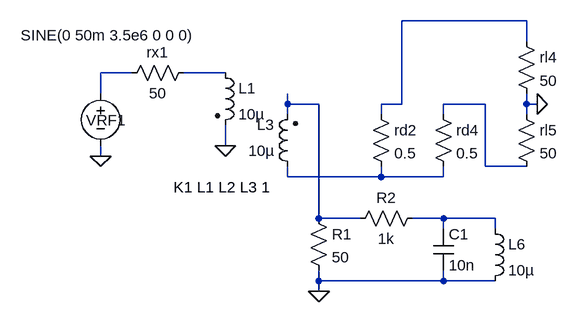
[diagram p0: schematic Draft1.asc]
Draft1.asc, the LTspice schematic file:
Version 4
SHEET 1 880 680
WIRE 512 0 320 0
WIRE 512 32 512 0
WIRE -96 80 -144 80
WIRE 48 80 -16 80
WIRE -144 112 -144 80
WIRE 144 128 144 112
WIRE 192 128 144 128
WIRE 320 128 320 0
WIRE 320 128 288 128
WIRE 448 128 384 128
WIRE 512 128 512 112
WIRE 528 128 512 128
WIRE 144 144 144 128
WIRE 288 144 288 128
WIRE 384 144 384 128
WIRE 512 144 512 128
WIRE 48 192 48 160
WIRE -144 208 -144 192
WIRE 448 224 448 128
WIRE 512 224 448 224
WIRE 144 240 144 224
WIRE 288 240 288 224
WIRE 288 240 144 240
WIRE 384 240 384 224
WIRE 384 240 288 240
WIRE 192 304 192 128
WIRE 256 304 192 304
WIRE 384 304 336 304
WIRE 464 304 384 304
WIRE 384 320 384 304
WIRE 464 320 464 304
WIRE 192 400 192 384
WIRE 384 400 384 384
WIRE 384 400 192 400
WIRE 464 400 384 400
WIRE 192 416 192 400
FLAG 48 192 0
FLAG 528 128 0
FLAG -144 208 0
FLAG 192 416 0
SYMBOL ind2 32 64 R0
SYMATTR InstName L1
SYMATTR Value 10µ
SYMATTR Type ind
SYMBOL ind2 160 240 R180
WINDOW 0 36 80 Left 2
WINDOW 3 36 40 Left 2
SYMATTR InstName L3
SYMATTR Value 10µ
SYMATTR Type ind
SYMBOL res 0 64 R90
WINDOW 0 0 56 VBottom 2
WINDOW 3 32 56 VTop 2
SYMATTR InstName rx1
SYMATTR Value 50
SYMBOL voltage -144 96 R0
WINDOW 0 -22 57 Left 2
WINDOW 3 -123 -74 Left 2
WINDOW 123 0 0 Left 0
WINDOW 39 0 0 Left 0
SYMATTR InstName VRF1
SYMATTR Value SINE(0 50m 3.5e6 0 0 0)
SYMBOL res 176 288 R0
SYMATTR InstName R1
SYMATTR Value 50
SYMBOL res 352 288 R90
WINDOW 0 0 56 VBottom 2
WINDOW 3 32 56 VTop 2
SYMATTR InstName R2
SYMATTR Value 1k
SYMBOL cap 368 320 R0
SYMATTR InstName C1
SYMATTR Value 10n
SYMBOL ind 448 304 R0
SYMATTR InstName L6
SYMATTR Value 10µ
SYMBOL res 272 128 R0
SYMATTR InstName rd2
SYMATTR Value 0.5
SYMBOL res 368 128 R0
SYMATTR InstName rd4
SYMATTR Value 0.5
SYMBOL res 496 16 R0
SYMATTR InstName rl4
SYMATTR Value 50
SYMBOL res 496 128 R0
SYMATTR InstName rl5
SYMATTR Value 50
TEXT -32 256 Left 2 !K1 L1 L2 L3 1

The netlist it stands for:
* Draft1.asc
L1 N003 0 10µ
L3 N006 N004 10µ
rx1 N003 N002 50
VRF1 N002 0 SINE(0 50m 3.5e6 0 0 0)
R1 N004 0 50
R2 N007 N004 1k
C1 N007 0 10n
L6 N007 0 10µ
rd2 N001 N006 0.5
rd4 N005 N006 0.5
rl4 N001 0 50
rl5 0 N005 50
K1 L1 L2 L3 1
.backanno
.end